# EAGLE design power_regulator_wii (EAGLE 9.1.0)
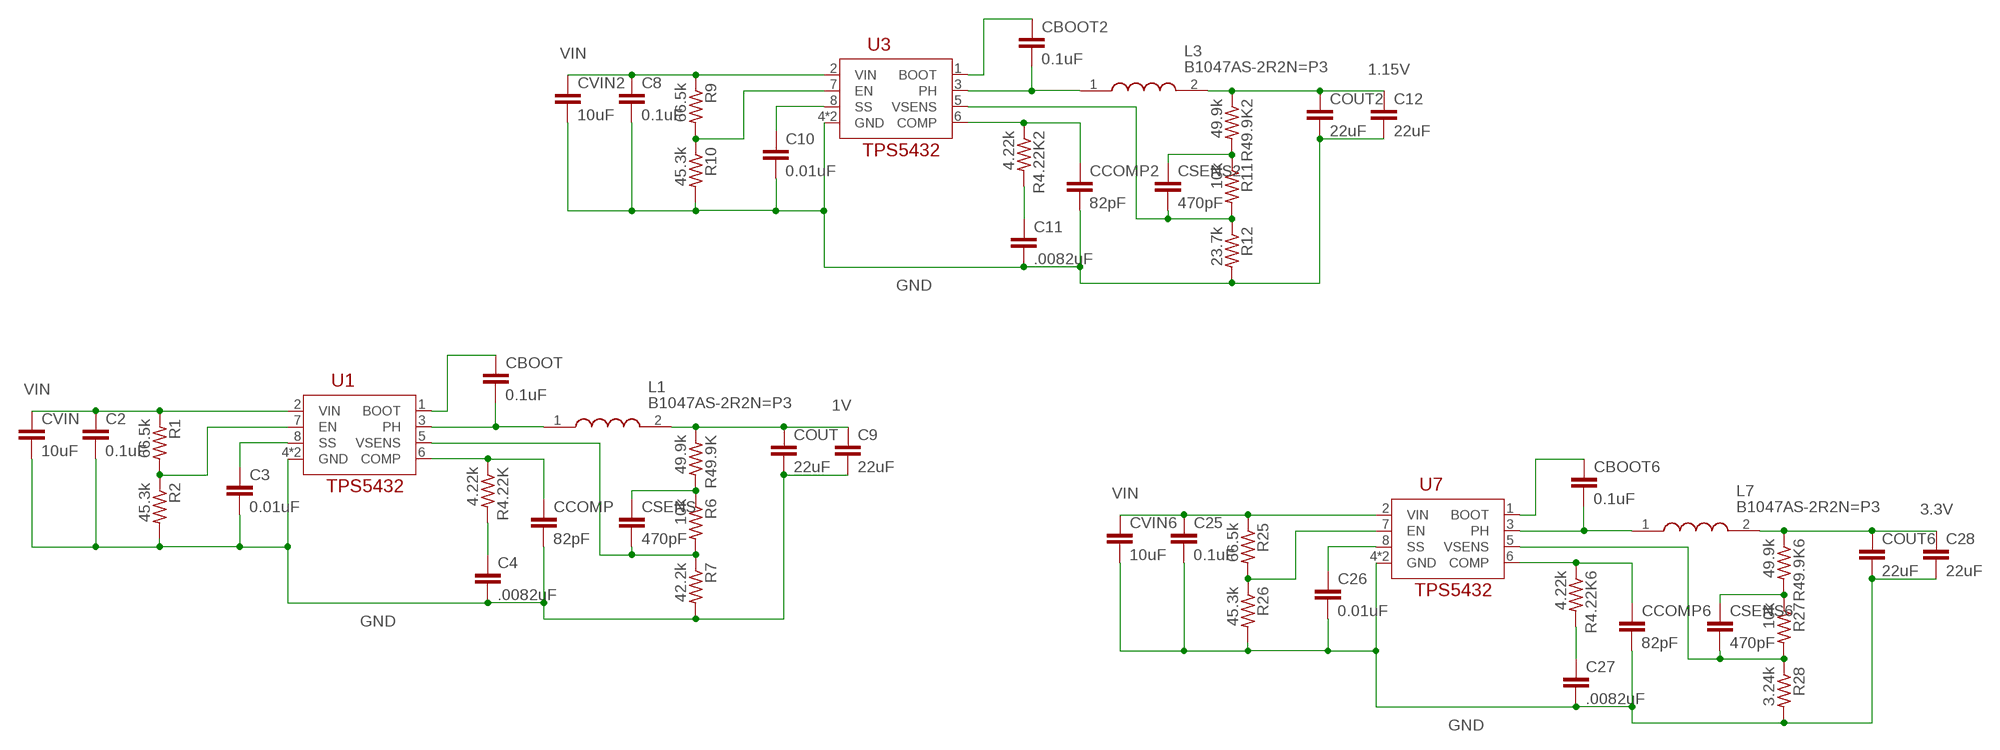
[diagram p0: schematic, sheet 1]

## Parts
C2  0.1uF  C-EUC0603  [C0603]
C3  0.01uF  C-EUC0603  [C0603]
C4  .0082uF  C-EUC0603  [C0603]
C8  0.1uF  C-EUC0603  [C0603]
C9  22uF  C-EUC0603  [C0603]
C10  0.01uF  C-EUC0603  [C0603]
C11  .0082uF  C-EUC0603  [C0603]
C12  22uF  C-EUC0603  [C0603]
C25  0.1uF  C-EUC0603  [C0603]
C26  0.01uF  C-EUC0603  [C0603]
C27  .0082uF  C-EUC0603  [C0603]
C28  22uF  C-EUC0603  [C0603]
CBOOT  0.1uF  C-EUC0603  [C0603]
CBOOT2  0.1uF  C-EUC0603  [C0603]
CBOOT6  0.1uF  C-EUC0603  [C0603]
CCOMP  82pF  C-EUC0603  [C0603]
CCOMP2  82pF  C-EUC0603  [C0603]
CCOMP6  82pF  C-EUC0603  [C0603]
COUT  22uF  C-EUC0603  [C0603]
COUT2  22uF  C-EUC0603  [C0603]
COUT6  22uF  C-EUC0603  [C0603]
CSENS  470pF  C-EUC0603  [C0603]
CSENS2  470pF  C-EUC0603  [C0603]
CSENS6  470pF  C-EUC0603  [C0603]
CVIN  10uF  C-EUC0603  [C0603]
CVIN2  10uF  C-EUC0603  [C0603]
CVIN6  10uF  C-EUC0603  [C0603]
L1  B1047AS-2R2N=P3  [INDPM7474X500N]
L3  B1047AS-2R2N=P3  [INDPM7474X500N]
L7  B1047AS-2R2N=P3  [INDPM7474X500N]
R1  66.5k  R-US_R0603  [R0603]
R2  45.3k  R-US_R0603  [R0603]
R4.22K  4.22k  R-US_R0603  [R0603]
R4.22K2  4.22k  R-US_R0603  [R0603]
R4.22K6  4.22k  R-US_R0603  [R0603]
R6  10k  R-US_R0603  [R0603]
R7  42.2k  R-US_R0603  [R0603]
R9  66.5k  R-US_R0603  [R0603]
R10  45.3k  R-US_R0603  [R0603]
R11  10k  R-US_R0603  [R0603]
R12  23.7k  R-US_R0603  [R0603]
R25  66.5k  R-US_R0603  [R0603]
R26  45.3k  R-US_R0603  [R0603]
R27  10k  R-US_R0603  [R0603]
R28  3.24k  R-US_R0603  [R0603]
R49.9K  49.9k  R-US_R0603  [R0603]
R49.9K2  49.9k  R-US_R0603  [R0603]
R49.9K6  49.9k  R-US_R0603  [R0603]
U1  TPS5432  [SO-8]
U3  TPS5432  [SO-8]
U7  TPS5432  [SO-8]

## Nets
1.15V: C12.1 COUT2.1 L3.2 R49.9K2.1
1V: C9.1 COUT.1 L1.2 R49.9K.1
3.3V: C28.1 COUT6.1 L7.2 R49.9K6.1
BOOT: CBOOT.1 U1.1(BOOT)
BOOT2: CBOOT2.1 U3.1(BOOT)
BOOT6: CBOOT6.1 U7.1(BOOT)
COMP: CCOMP.1 R4.22K.1 U1.6(COMP)
COMP2: CCOMP2.1 R4.22K2.1 U3.6(COMP)
COMP6: CCOMP6.1 R4.22K6.1 U7.6(COMP)
EN: R1.2 R2.1 U1.7(EN)
EN2: R9.2 R10.1 U3.7(EN)
EN6: R25.2 R26.1 U7.7(EN)
GND: C2.2 C3.2 C4.2 C8.2 C9.2 C10.2 C11.2 C12.2 C25.2 C26.2 C27.2 C28.2 CCOMP2.2 CCOMP6.2 CCOMP.2 COUT2.2 COUT6.2 COUT.2 CVIN2.2 CVIN6.2 CVIN.2 R2.2 R7.2 R10.2 R12.2 R26.2 R28.2 U1.4(GND) U1.PAD(GND) U3.4(GND) U3.PAD(GND) U7.4(GND) U7.PAD(GND)
N$3: C11.1 R4.22K2.2
N$4: CSENS2.1 R11.1 R49.9K2.2
N$6: C4.1 R4.22K.2
N$9: CSENS.1 R6.1 R49.9K.2
N$13: C27.1 R4.22K6.2
N$14: CSENS6.1 R27.1 R49.9K6.2
PH: CBOOT.2 L1.1 U1.3(PH)
PH2: CBOOT2.2 L3.1 U3.3(PH)
PH6: CBOOT6.2 L7.1 U7.3(PH)
SS: C3.1 U1.8(SS)
SS2: C10.1 U3.8(SS)
SS6: C26.1 U7.8(SS)
VIN: C2.1 C8.1 C25.1 CVIN2.1 CVIN6.1 CVIN.1 R1.1 R9.1 R25.1 U1.2(VIN) U3.2(VIN) U7.2(VIN)
VSENS: CSENS.2 R6.2 R7.1 U1.5(VSENS)
VSENS2: CSENS2.2 R11.2 R12.1 U3.5(VSENS)
VSENS6: CSENS6.2 R27.2 R28.1 U7.5(VSENS)

## Library data of the parts
C2-C4 C8-C12 C25-C28 CBOOT CBOOT2 CBOOT6 CCOMP CCOMP2 CCOMP6 COUT COUT2 COUT6 CSENS CSENS2 CSENS6 CVIN CVIN2 CVIN6 = rcl:C-EU: CAPACITOR, European symbol; SPICEPREFIX: C
L1 L3 L7 = B1047AS-2R2N=P3:B1047AS-2R2N=P3: 2.2uH/6.5A/OR016 7.6 x 7.6 x 5mm (l x w x h) Source: Datasheet <http://www.murata.com/~/media/webrenewal/products/inductor/chip/tokoproducts/wirewoundferritetypeforpl/m_ds75lc.ashx>; ARROW_PART_NUMBER: B1047AS-2R2N=P3; ARROW_PRICE/STOCK: https://www.arrow.com/en/products/b1047as-2r2np3/murata-manufacturing; DESCRIPTION: 2.2uH/6.5A/OR016 7.6 x 7.6 x 5mm (l x w x h); HEIGHT: 5mm; MANUFACTURER_NAME: Murata Electronics; MANUFACTURER_PART_NUMBER: B1047AS-2R2N=P3
R1 R2 R4.22K R4.22K2 R4.22K6 R6 R7 R9-R12 R25-R28 R49.9K R49.9K2 R49.9K6 = rcl:R-US_: RESISTOR, American symbol; SPICEPREFIX: R
U1 U3 U7 = wiip:TPS5432

## Board
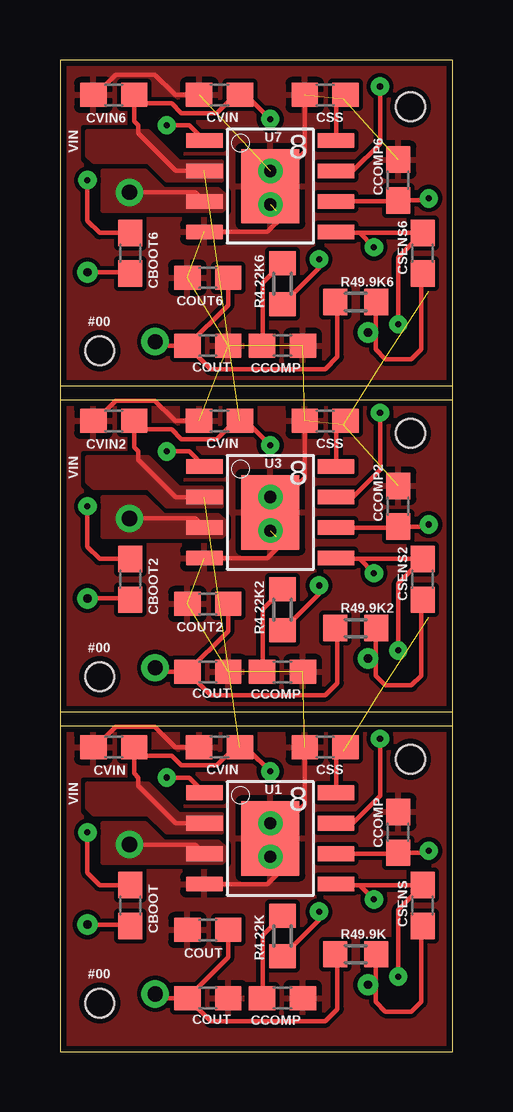
[diagram p1: board, top side]
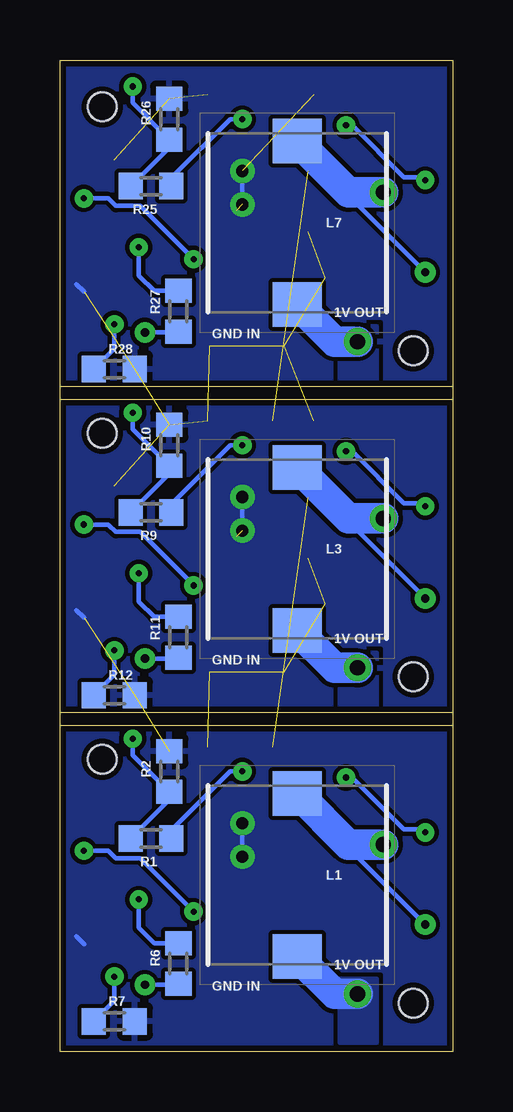
[diagram p2: board, bottom side, seen from below]

Size 16.36 x 41.33 mm. Coordinates in mm from the lower left corner, seen from the top.
Outline: 0,0 16.36,0 16.36,14.15 0,14.15 0,0
Outline: 0,13.59 16.36,13.59 16.36,27.74 0,27.74 0,13.59
Outline: 0,27.18 16.36,27.18 16.36,41.33 0,41.33 0,27.18
Copper layers (1*16): Top 0.035mm / dielectric 1.5mm / Bottom 0.035mm
Design rules "small": minimum track width 7mil, minimum drill 10mil, track to track 7mil, track to pad 7mil, pad to pad 7mil, via to via 7mil, smd to smd 6mil, copper to edge 10mil, drill to drill 6mil, minimum pad ring 10mil, minimum via ring 10mil, stop-mask expansion 4mil, vias tented up to drill 0mil, thermal gap 10mil
Holes 1.19 mm at 1.65,2.03 14.6,12.19 1.65,15.62 14.6,25.78 1.65,29.21 14.6,39.37

### Footprints (pad centres in the part's own frame; a part is rotated, then mirrored left to right if it is on the bottom)
C0603 = smd 1.1 x 1: 1 -0.85,0; 2 0.85,0
INDPM7474X500N = smd 1.85 x 2.05: 1 -3.4,0; 2 3.4,0
R0603 = smd 1 x 1.1: 1 -0.85,0; 2 0.85,0
SO-8 = smd 1.524 x 0.61: 1 -2.743,1.905; 2 -2.743,0.635; 3 -2.743,-0.635; 4 -2.743,-1.905; 5 2.743,-1.905; 6 2.743,-0.635; 7 2.743,0.635; 8 2.743,1.905 | smd 2.413 x 3.099: PAD 0,0

### Placement (x,y rotation side)
C2  6.65,12.7 180 top
C3  11.05,12.7 180 top
C4  9.27,2.24 0 top
C8  6.65,26.29 180 top
C9  6.16,2.24 0 top
C10  11.05,26.29 180 top
C11  9.27,15.83 0 top
C12  6.16,15.83 0 top
C25  6.65,39.88 180 top
C26  11.05,39.88 180 top
C27  9.27,29.42 0 top
C28  6.16,29.42 0 top
CBOOT  2.92,6.1 270 top
CBOOT2  2.92,19.68 270 top
CBOOT6  2.92,33.27 270 top
CCOMP  14.1,9.14 90 top
CCOMP2  14.1,22.73 90 top
CCOMP6  14.1,36.32 90 top
COUT  6.16,5.08 180 top
COUT2  6.16,18.67 180 top
COUT6  6.16,32.26 180 top
CSENS  15.11,6.1 90 top
CSENS2  15.11,19.68 90 top
CSENS6  15.11,33.27 90 top
CVIN  2.24,12.7 180 top
CVIN2  2.24,26.29 180 top
CVIN6  2.24,39.88 180 top
L1  6.48,7.37 270 bottom
L3  6.48,20.95 270 bottom
L7  6.48,34.54 270 bottom
R1  12.57,8.89 180 bottom
R2  11.81,11.68 90 bottom
R4.22K  9.27,4.83 90 top
R4.22K2  9.27,18.41 90 top
R4.22K6  9.27,32 90 top
R6  11.43,3.68 90 bottom
R7  14.1,1.27 0 bottom
R9  12.57,22.48 180 bottom
R10  11.81,25.27 90 bottom
R11  11.43,17.27 90 bottom
R12  14.1,14.86 0 bottom
R25  12.57,36.07 180 bottom
R26  11.81,38.86 90 bottom
R27  11.43,30.86 90 bottom
R28  14.1,28.45 0 bottom
R49.9K  12.32,4.06 0 top
R49.9K2  12.32,17.65 0 top
R49.9K6  12.32,31.24 0 top
U1  8.76,8.89 0 top
U3  8.76,22.48 0 top
U7  8.76,36.07 0 top

### Tracks (layer width: path | path; a pad name or v marks a point on that pad's centre or on a via)
1.15V  (via drill 0.64)
  Top 0.178: C12.1 4.14,15.83 v3.97,16 | C12.1 7.01,17.53 COUT2.1 | C12.1 6.28,14.86 11.05,14.86 11.56,15.37 11.56,17.57 R49.9K2.1
  Bottom 1.27: v3.97,16 4.92,16 L3.2
1V  (via drill 0.64)
  Top 0.178: C9.1 4.14,2.24 v3.97,2.41 | C9.1 7.01,3.94 COUT.1 | C9.1 6.28,1.27 11.05,1.27 11.56,1.78 11.56,3.98 R49.9K.1
  Bottom 1.27: v3.97,2.41 4.92,2.41 L1.2
  pour Bottom: 3.17,3.05 4.7,3.05 4.7,0.38 3.17,0.38 3.17,2.92
  pour Bottom: 3.17,16.64 4.7,16.64 4.7,13.97 3.17,13.97 3.17,16.51
  pour Bottom: 3.17,30.23 4.7,30.23 4.7,27.56 3.17,27.56 3.17,30.1
3.3V  (via drill 0.64)
  Top 0.178: C28.1 4.14,29.42 v3.97,29.59 | C28.1 7.01,31.12 COUT6.1 | C28.1 6.28,28.45 11.05,28.45 11.56,28.96 11.56,31.15 R49.9K6.1
  Bottom 1.27: v3.97,29.59 4.92,29.59 L7.2
BOOT  (via drill 0.25)
  Top 0.178: v4.45,11.43 5.38,11.43 U1.1 | v1.14,9.14 1.14,7.45 1.65,6.95 CBOOT.1
  Bottom 0.178: v1.14,9.14 1.27,9.27 2.03,9.27 4.19,11.43 v4.45,11.43
BOOT2  (via drill 0.25)
  Top 0.178: v4.45,25.02 5.38,25.02 U3.1 | v1.14,22.73 1.14,21.04 1.65,20.54 CBOOT2.1
  Bottom 0.178: v1.14,22.73 1.27,22.86 2.03,22.86 4.19,25.02 v4.45,25.02
BOOT6  (via drill 0.25)
  Top 0.178: v4.45,38.61 5.38,38.61 U7.1 | v1.14,36.32 1.14,34.63 1.65,34.12 CBOOT6.1
  Bottom 0.178: v1.14,36.32 1.27,36.45 2.03,36.45 4.19,38.61 v4.45,38.61
COMP  (via drill 0.25)
  Top 0.178: U1.6 14.06,8.26 CCOMP.1 15.28,8.29 v15.37,8.38 | R4.22K.1 10.79,5.5 v10.79,5.84
  Bottom 0.178: v10.79,5.84 13.03,8.07 14.03,8.07 14.34,8.38 v15.37,8.38
COMP2  (via drill 0.25)
  Top 0.178: U3.6 14.06,21.84 CCOMP2.1 15.28,21.88 v15.37,21.97 | R4.22K2.1 10.79,19.09 v10.79,19.43
  Bottom 0.178: v10.79,19.43 13.03,21.66 14.03,21.66 14.34,21.97 v15.37,21.97
COMP6  (via drill 0.25)
  Top 0.178: U7.6 14.06,35.43 CCOMP6.1 15.28,35.47 v15.37,35.56 | R4.22K6.1 10.79,32.68 v10.79,33.02
  Bottom 0.178: v10.79,33.02 13.03,35.25 14.03,35.25 14.34,35.56 v15.37,35.56
EN  (via drill 0.25)
  Top 0.178: U1.7 12.19,9.53 13.33,10.67 v13.33,13.04
  Bottom 0.178: R1.2 11.81,10.5 R2.1 13.33,12.36 v13.33,13.04
EN2  (via drill 0.25)
  Top 0.178: U3.7 12.19,23.11 13.33,24.26 v13.33,26.63
  Bottom 0.178: R9.2 11.81,24.09 R10.1 13.33,25.95 v13.33,26.63
EN6  (via drill 0.25)
  Top 0.178: U7.7 12.19,36.7 13.33,37.85 v13.33,40.22
  Bottom 0.178: R25.2 11.81,37.68 R26.1 13.33,39.54 v13.33,40.22
GND  (via drill 0.51)  (20 unrouted)
  Top 0.178: C3.2 10.2,10.33 9.02,9.14 | 9.02,9.14 U1.PAD | C2.2 4.8,12.7 3.96,13.54 2.32,13.54 1.47,12.7 CVIN.2 | U1.4 8.64,6.99 9.27,7.62 9.02,7.87 9.02,9.14 | C10.2 10.2,23.91 9.02,22.73 | 9.02,22.73 U3.PAD | C8.2 4.8,26.29 3.96,27.13 2.32,27.13 1.47,26.29 CVIN2.2 | U3.4 8.64,20.57 9.27,21.21 9.02,21.46 9.02,22.73 | C26.2 10.2,37.5 9.02,36.32 | 9.02,36.32 U7.PAD | C25.2 4.8,39.88 3.96,40.72 2.32,40.72 1.47,39.88 CVIN6.2 | U7.4 8.64,34.16 9.27,34.8 9.02,35.05 9.02,36.32
  Bottom 0.178: 15.68,4.81 15.35,4.49 | v8.76,8.13 v8.76,9.53 | 15.68,18.4 15.35,18.08 | v8.76,21.72 v8.76,23.11 | 15.68,31.99 15.35,31.67 | v8.76,35.31 v8.76,36.7
  pour Top (rank 3): -0.13,14.22 16.64,14.22 16.64,0 -0.13,0
  pour Bottom (rank 2): 0.13,14.22 16.64,14.22 16.64,0 0.13,0
  pour Top (rank 3): -0.13,27.81 16.64,27.81 16.64,13.59 -0.13,13.59
  pour Bottom (rank 2): 0.13,27.81 16.64,27.81 16.64,13.59 0.13,13.59
  pour Top (rank 3): -0.13,41.4 16.64,41.4 16.64,27.18 -0.13,27.18
  pour Bottom (rank 2): 0.13,41.4 16.64,41.4 16.64,27.18 0.13,27.18
N$3
  Top 0.178: R4.22K2.2 8.45,18.45 8.45,15.86 C11.1
N$4  (via drill 0.35)
  Top 0.178: R49.9K2.2 13.15,17.63 13.15,15.88 | 13.15,15.88 13.15,15.68 13.56,15.27 14.64,15.27 15.05,15.68 15.05,18.77 CSENS2.1 | v12.83,16.38 13.15,16.06 13.15,15.88
  Bottom 0.178: R11.1 11.47,16.38 v12.83,16.38
N$6
  Top 0.178: R4.22K.2 8.45,4.86 8.45,2.27 C4.1
N$9  (via drill 0.35)
  Top 0.178: R49.9K.2 13.15,4.04 13.15,2.29 | 13.15,2.29 13.15,2.09 13.56,1.68 14.64,1.68 15.05,2.09 15.05,5.18 CSENS.1 | v12.83,2.79 13.15,2.47 13.15,2.29
  Bottom 0.178: R6.1 11.47,2.79 v12.83,2.79
N$13
  Top 0.178: R4.22K6.2 8.45,32.04 8.45,29.45 C27.1
N$14  (via drill 0.35)
  Top 0.178: R49.9K6.2 13.15,31.22 13.15,29.46 | 13.15,29.46 13.15,29.26 13.56,28.86 14.64,28.86 15.05,29.26 15.05,32.36 CSENS6.1 | v12.83,29.97 13.15,29.65 13.15,29.46
  Bottom 0.178: R27.1 11.47,29.97 v12.83,29.97
PH  (via drill 0.35, 0.64)
  Top 0.178: v2.89,8.64 5.64,8.64 U1.3 | v1.14,5.3 2.86,5.3 CBOOT.2
  Bottom 0.178: 4.35,8.64 4.35,8.51 v1.14,5.3
  Bottom 1.27: L1.1 4.35,8.64 3.68,8.64 | v2.89,8.64 3.68,8.64 | 3.68,8.64
  pour Top (no thermals): 5.33,7.87 6.73,7.87 6.86,8 6.86,8.51 6.6,8.76 4.45,8.76 1.78,8.76 1.78,7.87
  pour Top: 1.78,8.64 1.78,9.53 3.56,9.53 4.32,8.76 4.32,8.64
PH2  (via drill 0.35, 0.64)
  Top 0.178: v2.89,22.23 5.64,22.23 U3.3 | v1.14,18.89 2.86,18.89 CBOOT2.2
  Bottom 0.178: 4.35,22.23 4.35,22.1 v1.14,18.89
  Bottom 1.27: L3.1 4.35,22.23 3.68,22.23 | v2.89,22.23 3.68,22.23 | 3.68,22.23
  pour Top (no thermals): 5.33,21.46 6.73,21.46 6.86,21.59 6.86,22.1 6.6,22.35 4.45,22.35 1.78,22.35 1.78,21.46
  pour Top: 1.78,22.23 1.78,23.11 3.56,23.11 4.32,22.35 4.32,22.23
PH6  (via drill 0.35, 0.64)
  Top 0.178: v2.89,35.81 5.64,35.81 U7.3 | v1.14,32.48 2.86,32.48 CBOOT6.2
  Bottom 0.178: 4.35,35.81 4.35,35.69 v1.14,32.48
  Bottom 1.27: L7.1 4.35,35.81 3.68,35.81 | v2.89,35.81 3.68,35.81 | 3.68,35.81
  pour Top (no thermals): 5.33,35.05 6.73,35.05 6.86,35.18 6.86,35.69 6.6,35.94 4.45,35.94 1.78,35.94 1.78,35.05
  pour Top: 1.78,35.81 1.78,36.7 3.56,36.7 4.32,35.94 4.32,35.81
SS
  Top 0.178: C3.1 11.51,12.31 U1.8
SS2
  Top 0.178: C10.1 11.51,25.9 U3.8
SS6
  Top 0.178: C26.1 11.51,39.48 U7.8
VIN  (via drill 0.25)  (2 unrouted)
  Top 0.178: U1.2 4.83,9.53 3.26,11.09 3.26,11.43 3.09,11.6 CVIN.1 3.45,12.34 4.65,12.34 5.06,11.93 6.54,11.93 7.18,12.57 7.87,12.57 | v8.76,11.68 7.87,12.57 | 7.87,12.57 7.75,12.7 C2.1 | U3.2 4.83,23.11 3.26,24.68 3.26,25.02 3.09,25.19 CVIN2.1 3.45,25.93 4.65,25.93 5.06,25.52 6.54,25.52 7.18,26.16 7.87,26.16 | v8.76,25.27 7.87,26.16 | 7.87,26.16 7.75,26.29 C8.1 | U7.2 4.83,36.7 3.26,38.27 3.26,38.61 3.09,38.78 CVIN6.1 3.45,39.52 4.65,39.52 5.06,39.11 6.54,39.11 7.18,39.75 7.87,39.75 | v8.76,38.86 7.87,39.75 | 7.87,39.75 7.75,39.88 C25.1
  Bottom 0.178: v8.76,11.68 9.27,11.68 11.72,9.23 R1.1 | v8.76,25.27 9.27,25.27 11.72,22.82 R9.1 | v8.76,38.86 9.27,38.86 11.72,36.41 R25.1
  pour Top (no thermals): 6.73,9.91 4.95,9.91 3.68,11.18 1.14,11.18 1.14,10.16 1.4,9.91 3.68,9.91 4.45,9.14 6.73,9.14
  pour Top (no thermals): 6.73,23.5 4.95,23.5 3.68,24.77 1.14,24.77 1.14,23.75 1.4,23.5 3.68,23.5 4.45,22.73 6.73,22.73
  pour Top (no thermals): 6.73,37.08 4.95,37.08 3.68,38.35 1.14,38.35 1.14,37.34 1.4,37.08 3.68,37.08 4.45,36.32 6.73,36.32
VSENS  (via drill 0.25)
  Top 0.178: U1.5 11.54,6.95 11.81,6.95 | 11.81,6.95 CSENS.2 14.1,5.93 v14.1,3.14 | v13.08,6.35 12.49,6.95 11.81,6.95
  Bottom 0.178: R7.1 14.1,2.12 v14.1,3.14 | v13.08,6.35 13.08,5.17 12.45,4.53 R6.2
VSENS2  (via drill 0.25)
  Top 0.178: U3.5 11.54,20.54 11.81,20.54 | 11.81,20.54 CSENS2.2 14.1,19.52 v14.1,16.73 | v13.08,19.94 12.49,20.54 11.81,20.54
  Bottom 0.178: R12.1 14.1,15.71 v14.1,16.73 | v13.08,19.94 13.08,18.76 12.45,18.12 R11.2
VSENS6  (via drill 0.25)
  Top 0.178: U7.5 11.54,34.12 11.81,34.12 | 11.81,34.12 CSENS6.2 14.1,33.11 v14.1,30.31 | v13.08,33.53 12.49,34.12 11.81,34.12
  Bottom 0.178: R28.1 14.1,29.3 v14.1,30.31 | v13.08,33.53 13.08,32.35 12.45,31.71 R27.2

### Text on the board
tNames: CVIN | CSS | VIN | #00 | CCOMP | COUT | CVIN | CSS | VIN | #00 | COUT | CCOMP | CVIN | CSS | VIN | #00 | CCOMP | COUT
bNames: 1V OUT | GND IN | 1V OUT | GND IN | 1V OUT | GND IN